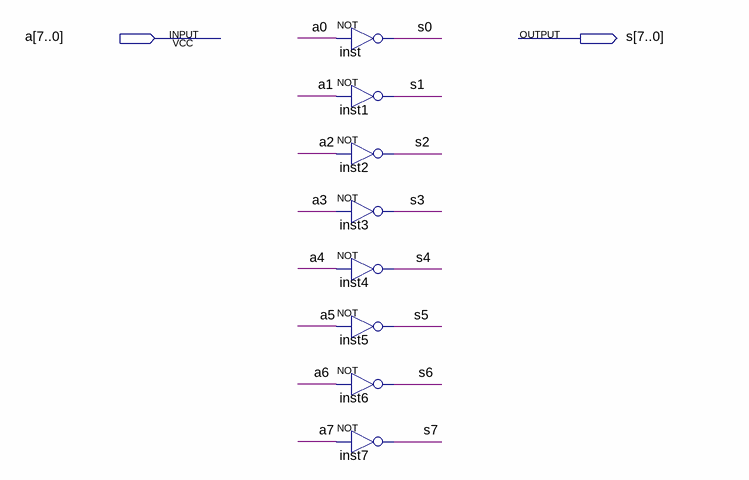
[diagram p0: schematic sheet]
// Quartus schematic abk_not8.bdf as structural Verilog: 8 symbols, 2 pins
module abk_not8 (
  input  [7:0] a,
  output [7:0] s
);

  not inst (s[0], a[0]);
  not inst1 (s[1], a[1]);
  not inst2 (s[2], a[2]);
  not inst3 (s[3], a[3]);
  not inst4 (s[4], a[4]);
  not inst5 (s[5], a[5]);
  not inst6 (s[6], a[6]);
  not inst7 (s[7], a[7]);
endmodule
